# Altium schematic sheet qudong.SchDoc
size A2
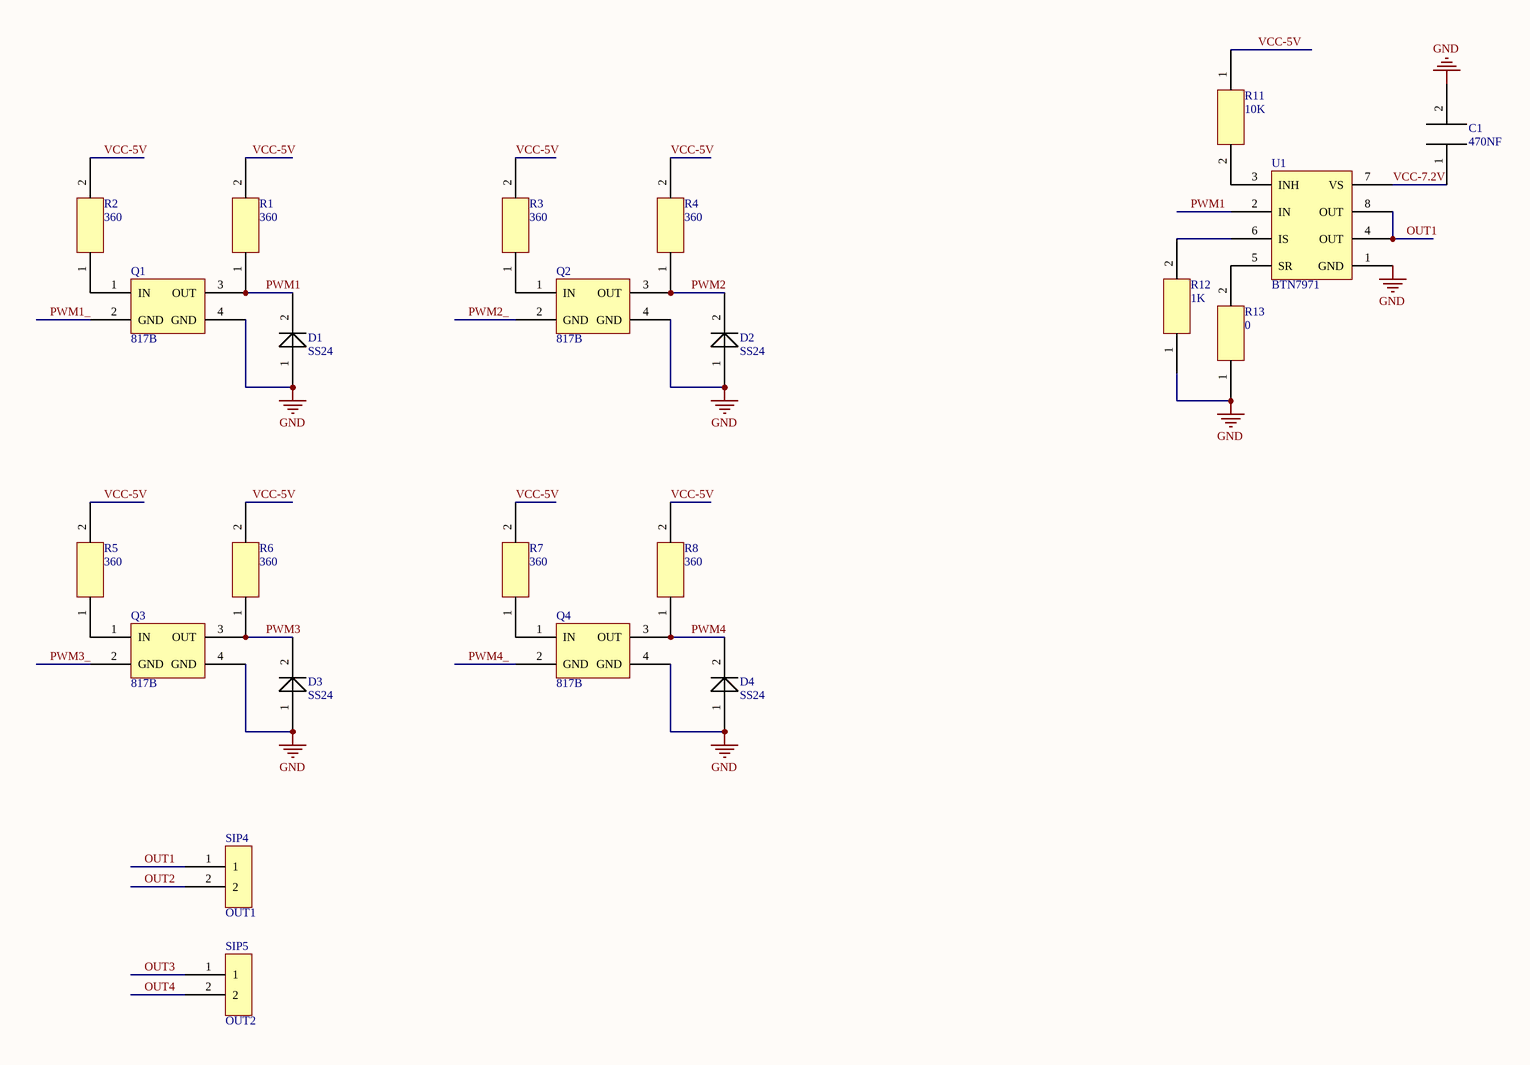
[diagram p0: qudong.SchDoc, left]
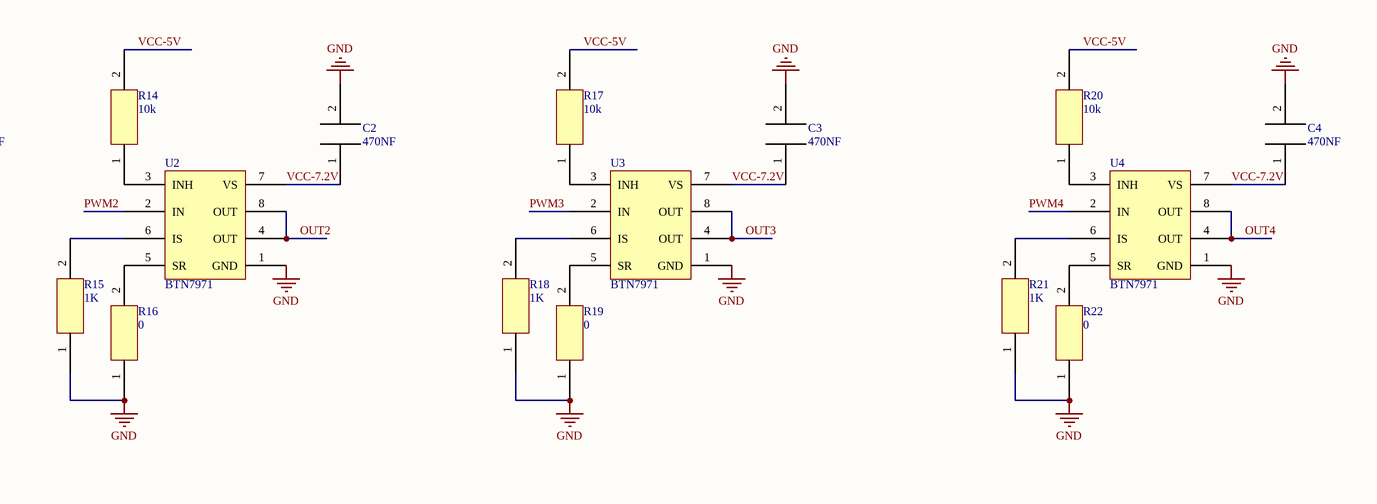
[diagram p1: qudong.SchDoc, right]

## Parts
C1  470NF  [CAP-T]
C2  470NF  [CAP-T]
C3  470NF  [CAP-T]
C4  470NF  [CAP-T]
D1  SS24  [SS24]
D2  SS24  [SS24]
D3  SS24  [SS24]
D4  SS24  [SS24]
Q1  817B  [817B]
Q2  817B  [817B]
Q3  817B  [817B]
Q4  817B  [817B]
R1  360  [RES-T]
R2  360  [RES-T]
R3  360  [RES-T]
R4  360  [RES-T]
R5  360  [RES-T]
R6  360  [RES-T]
R7  360  [RES-T]
R8  360  [RES-T]
R11  10K  [RES-T]
R12  1K  [RES-T]
R13  0  [RES-T]
R14  10k  [RES-T]
R15  1K  [RES-T]
R16  0  [RES-T]
R17  10k  [RES-T]
R18  1K  [RES-T]
R19  0  [RES-T]
R20  10k  [RES-T]
R21  1K  [RES-T]
R22  0  [RES-T]
SIP4  OUT1  [SIP2-3MM]
SIP5  OUT2  [SIP2-3MM]
U1  BTN7971  [BTN7971]
U2  BTN7971  [BTN7971]
U3  BTN7971  [BTN7971]
U4  BTN7971  [BTN7971]

## Nets
GND: C1.2 C2.2 C3.2 C4.2 D1.1 D2.1 D3.1 D4.1 Q1.4(GND) Q2.4(GND) Q3.4(GND) Q4.4(GND) R12.1 R13.1 R15.1 R16.1 R18.1 R19.1 R21.1 R22.1 U1.1(GND) U2.1(GND) U3.1(GND) U4.1(GND)
OUT1: SIP4.1 U1.4(OUT) U1.8(OUT)
OUT2: SIP4.2 U2.4(OUT) U2.8(OUT)
OUT3: SIP5.1 U3.4(OUT) U3.8(OUT)
OUT4: SIP5.2 U4.4(OUT) U4.8(OUT)
PWM1: D1.2 Q1.3(OUT) R1.1 U1.2(IN)
PWM1_: Q1.2(GND)
PWM2: D2.2 Q2.3(OUT) R4.1 U2.2(IN)
PWM2_: Q2.2(GND)
PWM3: D3.2 Q3.3(OUT) R6.1 U3.2(IN)
PWM3_: Q3.2(GND)
PWM4: D4.2 Q4.3(OUT) R8.1 U4.2(IN)
PWM4_: Q4.2(GND)
VCC-5V: R1.2 R2.2 R3.2 R4.2 R5.2 R6.2 R7.2 R8.2 R11.1 R14.2 R17.2 R20.2
VCC-7.2V: C1.1 C2.1 C3.1 C4.1 U1.7(VS) U2.7(VS) U3.7(VS) U4.7(VS)
NetQ1_1: Q1.1(IN) R2.1
NetQ2_1: Q2.1(IN) R3.1
NetQ3_1: Q3.1(IN) R5.1
NetQ4_1: Q4.1(IN) R7.1
NetR11_2: R11.2 U1.3(INH)
NetR12_2: R12.2 U1.6(IS)
NetR13_2: R13.2 U1.5(SR)
NetR14_1: R14.1 U2.3(INH)
NetR15_2: R15.2 U2.6(IS)
NetR16_2: R16.2 U2.5(SR)
NetR17_1: R17.1 U3.3(INH)
NetR18_2: R18.2 U3.6(IS)
NetR19_2: R19.2 U3.5(SR)
NetR20_1: R20.1 U4.3(INH)
NetR21_2: R21.2 U4.6(IS)
NetR22_2: R22.2 U4.5(SR)

## Library data of the parts
C1-C4 = CAP-T
R1-R8 R11-R22 = RES-T
SIP4 SIP5 = SIP2